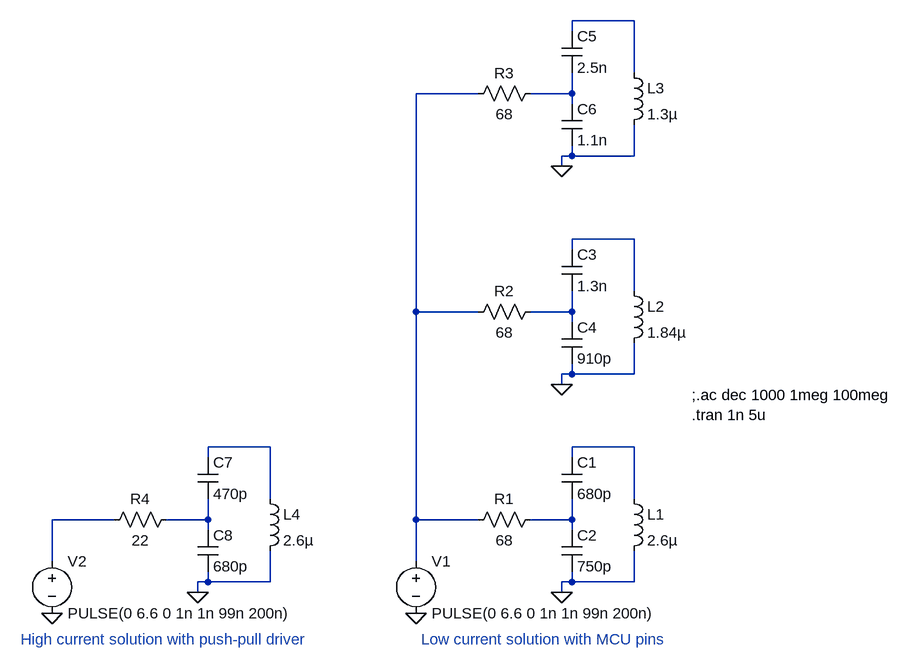
[diagram p0: schematic antenna2.asc]
antenna2.asc, the LTspice schematic file:
Version 4
SHEET 1 1232 680
WIRE 672 -400 576 -400
WIRE 576 -384 576 -400
WIRE 672 -320 672 -400
WIRE 432 -288 336 -288
WIRE 576 -288 576 -320
WIRE 576 -288 512 -288
WIRE 576 -272 576 -288
WIRE 576 -192 576 -208
WIRE 576 -192 560 -192
WIRE 672 -192 672 -240
WIRE 672 -192 576 -192
WIRE 560 -176 560 -192
WIRE 672 -64 576 -64
WIRE 576 -48 576 -64
WIRE 672 16 672 -64
WIRE 336 48 336 -288
WIRE 432 48 336 48
WIRE 576 48 576 16
WIRE 576 48 512 48
WIRE 576 64 576 48
WIRE 576 144 576 128
WIRE 576 144 560 144
WIRE 672 144 672 96
WIRE 672 144 576 144
WIRE 560 160 560 144
WIRE 112 256 16 256
WIRE 672 256 576 256
WIRE 16 272 16 256
WIRE 576 272 576 256
WIRE 112 336 112 256
WIRE 672 336 672 256
WIRE -128 368 -224 368
WIRE 16 368 16 336
WIRE 16 368 -48 368
WIRE 336 368 336 48
WIRE 432 368 336 368
WIRE 576 368 576 336
WIRE 576 368 512 368
WIRE 16 384 16 368
WIRE 576 384 576 368
WIRE -224 432 -224 368
WIRE 336 432 336 368
WIRE 16 464 16 448
WIRE 16 464 0 464
WIRE 112 464 112 416
WIRE 112 464 16 464
WIRE 576 464 576 448
WIRE 576 464 560 464
WIRE 672 464 672 416
WIRE 672 464 576 464
WIRE 0 480 0 464
WIRE 560 480 560 464
FLAG 336 512 0
FLAG 560 480 0
FLAG 560 160 0
FLAG 560 -176 0
FLAG -224 512 0
FLAG 0 480 0
SYMBOL cap 560 272 R0
SYMATTR InstName C1
SYMATTR Value 680p
SYMBOL cap 560 384 R0
SYMATTR InstName C2
SYMATTR Value 750p
SYMBOL ind 656 320 R0
SYMATTR InstName L1
SYMATTR Value 2.6µ
SYMBOL res 528 352 R90
WINDOW 0 0 56 VBottom 2
WINDOW 3 32 56 VTop 2
SYMATTR InstName R1
SYMATTR Value 68
SYMBOL voltage 336 416 R0
SYMATTR InstName V1
SYMATTR Value PULSE(0 6.6 0 1n 1n 99n 200n)
SYMATTR Value2 AC 1
SYMBOL cap 560 -48 R0
SYMATTR InstName C3
SYMATTR Value 1.3n
SYMBOL cap 560 64 R0
SYMATTR InstName C4
SYMATTR Value 910p
SYMBOL ind 656 0 R0
SYMATTR InstName L2
SYMATTR Value 1.84µ
SYMBOL res 528 32 R90
WINDOW 0 0 56 VBottom 2
WINDOW 3 32 56 VTop 2
SYMATTR InstName R2
SYMATTR Value 68
SYMBOL cap 560 -384 R0
SYMATTR InstName C5
SYMATTR Value 2.5n
SYMBOL cap 560 -272 R0
SYMATTR InstName C6
SYMATTR Value 1.1n
SYMBOL ind 656 -336 R0
SYMATTR InstName L3
SYMATTR Value 1.3µ
SYMBOL res 528 -304 R90
WINDOW 0 0 56 VBottom 2
WINDOW 3 32 56 VTop 2
SYMATTR InstName R3
SYMATTR Value 68
SYMBOL cap 0 272 R0
SYMATTR InstName C7
SYMATTR Value 470p
SYMBOL cap 0 384 R0
SYMATTR InstName C8
SYMATTR Value 680p
SYMBOL ind 96 320 R0
SYMATTR InstName L4
SYMATTR Value 2.6µ
SYMBOL res -32 352 R90
WINDOW 0 0 56 VBottom 2
WINDOW 3 32 56 VTop 2
SYMATTR InstName R4
SYMATTR Value 22
SYMBOL voltage -224 416 R0
SYMATTR InstName V2
SYMATTR Value PULSE(0 6.6 0 1n 1n 99n 200n)
SYMATTR Value2 AC 1
TEXT 760 176 Left 2 !;.ac dec 1000 1meg 100meg\n.tran 1n 5u
TEXT -272 552 Left 2 ;High current solution with push-pull driver
TEXT 344 552 Left 2 ;Low current solution with MCU pins

The netlist it stands for:
* antenna2.asc
C1 N007 N010 680p
C2 N010 0 750p
L1 N007 0 2.6µ
R1 N010 N002 68
V1 N002 0 PULSE(0 6.6 0 1n 1n 99n 200n) AC 1
C3 N004 N005 1.3n
C4 N005 0 910p
L2 N004 0 1.84µ
R2 N005 N002 68
C5 N001 N003 2.5n
C6 N003 0 1.1n
L3 N001 0 1.3µ
R3 N003 N002 68
C7 N006 N009 470p
C8 N009 0 680p
L4 N006 0 2.6µ
R4 N009 N008 22
V2 N008 0 PULSE(0 6.6 0 1n 1n 99n 200n) AC 1
;.ac dec 1000 1meg 100meg
.tran 1n 5u
* High current solution with push-pull driver
* Low current solution with MCU pins
.backanno
.end